# Altium project base_tiempo.PrjPcb
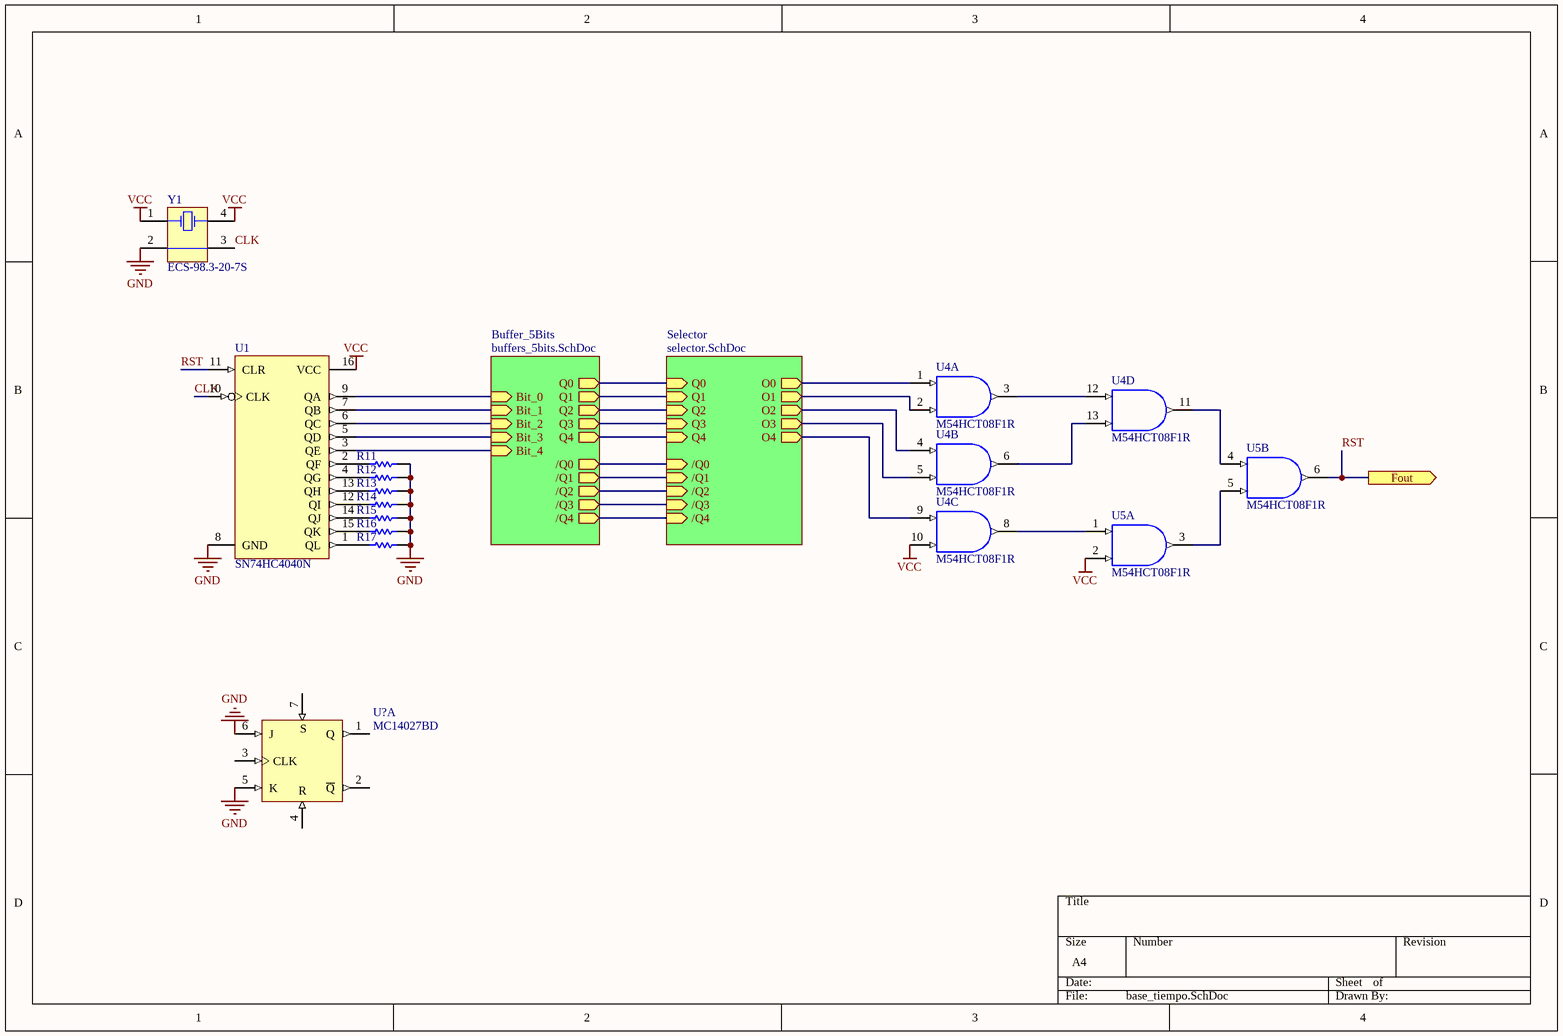
[diagram p0: base_tiempo.SchDoc]
3 sheets, 26 parts. Net scope: hierarchical (ports join the sheet entries above them; power ports are global).
Board file: base_tiempo.PcbDoc
Sheets:
  base_tiempo.SchDoc
    Buffer_5Bits = buffers_5bits.SchDoc
    Selector = selector.SchDoc

## Sheet base_tiempo.SchDoc: Base de tiempo
size A4; Revision: 1

### Parts
R11  Res Semi  [2012[0805]]  (value not drawn)
R12  Res Semi  [2012[0805]]  (value not drawn)
R13  Res Semi  [2012[0805]]  (value not drawn)
R14  Res Semi  [2012[0805]]  (value not drawn)
R15  Res Semi  [2012[0805]]  (value not drawn)
R16  Res Semi  [2012[0805]]  (value not drawn)
R17  Res Semi  [2012[0805]]  (value not drawn)
U1  SN74HC4040N  [N016]
U4  M54HCT08F1R  [CDIP14]  (parts A,B,C,D of 4)
U5  M54HCT08F1R  [CDIP14]  (parts A,B of 4)
U?  MC14027BD  [751B-05_N]  (part A of 2)
Y1  ECS-98.3-20-7S  [ECX-3S]

### Sub-sheets
Buffer_5Bits = buffers_5bits.SchDoc: Bit_0 (in), Bit_1 (in), Bit_2 (in), Bit_3 (in), Bit_4 (in), Q0 (out), Q1 (out), Q2 (out), Q3 (out), Q4 (out), /Q0 (out), /Q1 (out), /Q2 (out), /Q3 (out), /Q4 (out)
Selector = selector.SchDoc: Q0 (in), Q1 (in), Q2 (in), Q3 (in), Q4 (in), /Q0 (in), /Q1 (in), /Q2 (in), /Q3 (in), /Q4 (in), O0 (out), O1 (out), O2 (out), O3 (out), O4 (out)

### Ports
Fout (out)

### Nets
GND: R11.2 R12.2 R13.2 R14.2 R15.2 R16.2 R17.2 U1.8(GND) U4.7(GND) U5.7(GND) U?.5(K) U?.6(J) U?.8(GND) Y1.2(COM)
VCC: U1.16(VCC) U4.10(B) U4.14(VCC) U5.2(B) U5.14(VCC) Y1.1(OSC1) Y1.4(OSC2)
VDD: U?.16(VDD)
/Sel_B_0: sheet Buffer_5Bits//Q0, sheet Selector//Q0
/Sel_B_1: sheet Buffer_5Bits//Q1, sheet Selector//Q1
/Sel_B_2: sheet Buffer_5Bits//Q2, sheet Selector//Q2
/Sel_B_3: sheet Buffer_5Bits//Q3, sheet Selector//Q3
/Sel_B_4: sheet Buffer_5Bits//Q4, sheet Selector//Q4
B_0: U1.9(QA) ; sheet Buffer_5Bits/Bit_0
B_1: U1.7(QB) ; sheet Buffer_5Bits/Bit_1
B_2: U1.6(QC) ; sheet Buffer_5Bits/Bit_2
B_3: U1.5(QD) ; sheet Buffer_5Bits/Bit_3
B_4: U1.3(QE) ; sheet Buffer_5Bits/Bit_4
CLK: U1.10(CLK) Y1.3(COM)
O_0: U4.1(A) ; sheet Selector/O0
O_1: U4.2(B) ; sheet Selector/O1
O_2: U4.4(A) ; sheet Selector/O2
O_3: U4.5(B) ; sheet Selector/O3
O_4: U4.9(A) ; sheet Selector/O4
RST: U1.11(CLR) U5.6(Y) ; port Fout
Sel_B_0: sheet Buffer_5Bits/Q0, sheet Selector/Q0
Sel_B_1: sheet Buffer_5Bits/Q1, sheet Selector/Q1
Sel_B_2: sheet Buffer_5Bits/Q2, sheet Selector/Q2
Sel_B_3: sheet Buffer_5Bits/Q3, sheet Selector/Q3
Sel_B_4: sheet Buffer_5Bits/Q4, sheet Selector/Q4
NetR11_1: R11.1 U1.2(QF)
NetR12_1: R12.1 U1.4(QG)
NetR13_1: R13.1 U1.13(QH)
NetR14_1: R14.1 U1.12(QI)
NetR15_1: R15.1 U1.14(QJ)
NetR16_1: R16.1 U1.15(QK)
NetR17_1: R17.1 U1.1(QL)
NetU4_3: U4.3(Y) U4.12(A)
NetU4_6: U4.6(Y) U4.13(B)
NetU4_8: U4.8(Y) U5.1(A)
NetU4_11: U4.11(Y) U5.4(A)
NetU5_3: U5.3(Y) U5.5(B)

Not connected (* = marked no-connect by the designer): U? 1(Q) 2(~{Q}) 3(CLK) 4(R) 7(S)

### Library data of the parts
R11-R17 = Res Semi: Semiconductor Resistor; Value: 1K; Published: 8-Jun-2000; LatestRevisionDate: 17-Jul-2002; LatestRevisionNote: Re-released for DXP Platform.; PackageReference: AXIAL-0.5; Publisher: Altium Limited
U1 = SN74HC4040N: 12-Bit Asynchronous Binary Counter; Published: 8-Jun-2000; LatestRevisionDate: 04-Mar-2005; LatestRevisionNote: Stylized 3D Model Added.; DatasheetVersion: May-1997; PackageVersion: Oct-1995; PackageReference: N016; Publisher: Altium Limited; PackageDescription: DIP; 16 Leads; Row Spacing 7.62 mm; Pitch 2.54 mm; Code_JEDEC: MS-001-BB; ComponentLink1Description: Manufacturer Link; ComponentLink1URL: http://www.ti.com/; ComponentLink2Description: Datasheet; ComponentLink2URL: http://www-s.ti.com/sc/ds/sn74hc4040.pdf
U4 U5 = M54HCT08F1R: Quad 2-Input AND Gate; Published: 8-Jun-2000; LatestRevisionDate: 06-Jun-2005; LatestRevisionNote: Stylized 3D Model Added.; DatasheetVersion: Feb-1993; PackageReference: CDIP14; Publisher: Altium Limited; PackageDescription: DIP; 14 Leads; Row Spacing 7.62 mm; Pitch 2.54 mm; ComponentLink1Description: Manufacturer Link; ComponentLink1URL: http://www.st.com/
U? = MC14027BD: Dual J-K Flip-Flop; Published: 15-Apr-2002; LatestRevisionDate: 13-Apr-2006; LatestRevisionNote: IPC-7351 Footprint Added.; DatasheetVersion: 1995; PackageVersion: Oct-1999; PackageReference: 751B-05; Publisher: Altium Limited; PackageDescription: 16-Pin Small Outline Integrated Circuit 1.27 mm Pitch; Code_JEDEC: MS-012-AC; Code_IPC: SOIC127P600-16; ComponentLink1Description: Manufacturer Link; ComponentLink1URL: http://www.onsemi.com/; ComponentLink2Description: Datasheet; ComponentLink2URL: http://www.onsemi.com/pub/Collateral/MC14027B-D.PDF
Y1 = ECS-98.3-20-7S: Crystal Oscillator; Published: 17-Jul-2002; DatasheetDocument: 18-Apr-2000; PackageReference: ECX-3S; Publisher: Altium Limited; ComponentLink1Description: Manufacturer Link; ComponentLink1URL: http://www.ecsxtal.com/; ComponentLink2Description: Datasheet; ComponentLink2URL: http://www.ecsxtal.com/pdf/ecx-3s.pdf

## Sheet buffers_5bits.SchDoc
size A4
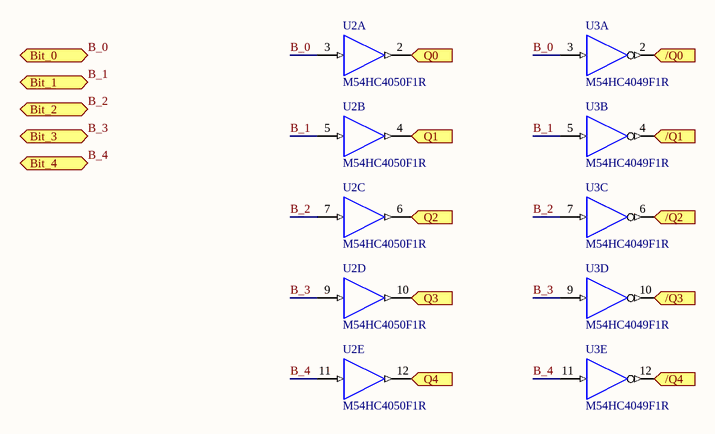
[diagram p1: buffers_5bits.SchDoc]

### Parts
U2  M54HC4050F1R  [DIP16]  (parts A,B,C,D,E of 6)
U3  M54HC4049F1R  [DIP16]  (parts A,B,C,D,E of 6)

### Ports
/Q0 (out), /Q1 (out), /Q2 (out), /Q3 (out), /Q4 (out), Bit_0 (in), Bit_1 (in), Bit_2 (in), Bit_3 (in), Bit_4 (in), Q0 (out), Q1 (out), Q2 (out), Q3 (out), Q4 (out)

### Nets
GND: U2.8(GND) U3.8(GND)
VCC: U2.1(VCC) U3.1(VCC)
/Sel_B_0: U3.2(Y) ; port /Q0
/Sel_B_1: U3.4(Y) ; port /Q1
/Sel_B_2: U3.6(Y) ; port /Q2
/Sel_B_3: U3.10(Y) ; port /Q3
/Sel_B_4: U3.12(Y) ; port /Q4
B_0: U2.3(A) U3.3(A) ; port Bit_0
B_1: U2.5(A) U3.5(A) ; port Bit_1
B_2: U2.7(A) U3.7(A) ; port Bit_2
B_3: U2.9(A) U3.9(A) ; port Bit_3
B_4: U2.11(A) U3.11(A) ; port Bit_4
Sel_B_0: U2.2(Y) ; port Q0
Sel_B_1: U2.4(Y) ; port Q1
Sel_B_2: U2.6(Y) ; port Q2
Sel_B_3: U2.10(Y) ; port Q3
Sel_B_4: U2.12(Y) ; port Q4

### Library data of the parts
U2 = M54HC4050F1R: Hex Buffer/Converter Non-Inverting; Note: Pins 13 and 16 are not connected and not drawn.; Published: 8-Jun-2000; LatestRevisionDate: 06-Jun-2005; LatestRevisionNote: Stylized 3D Model Added.; DatasheetVersion: Mar-1993; PackageVersion: Apr-1996; PackageReference: DIP16; Publisher: Altium Limited; PackageDescription: DIP; 16 Leads; Row Spacing 7.62 mm; Pitch 2.54 mm; ComponentLink1Description: Manufacturer Link; ComponentLink1URL: http://www.st.com/
U3 = M54HC4049F1R: Hex Buffer/Converter Invertering; Note: Pins 13 and 16 are not connected and not drawn.; Published: 8-Jun-2000; LatestRevisionDate: 06-Jun-2005; LatestRevisionNote: Stylized 3D Model Added.; DatasheetVersion: Mar-1993; PackageVersion: Apr-1996; PackageReference: DIP16; Publisher: Altium Limited; PackageDescription: DIP; 16 Leads; Row Spacing 7.62 mm; Pitch 2.54 mm; ComponentLink1Description: Manufacturer Link; ComponentLink1URL: http://www.st.com/

## Sheet selector.SchDoc
size A4
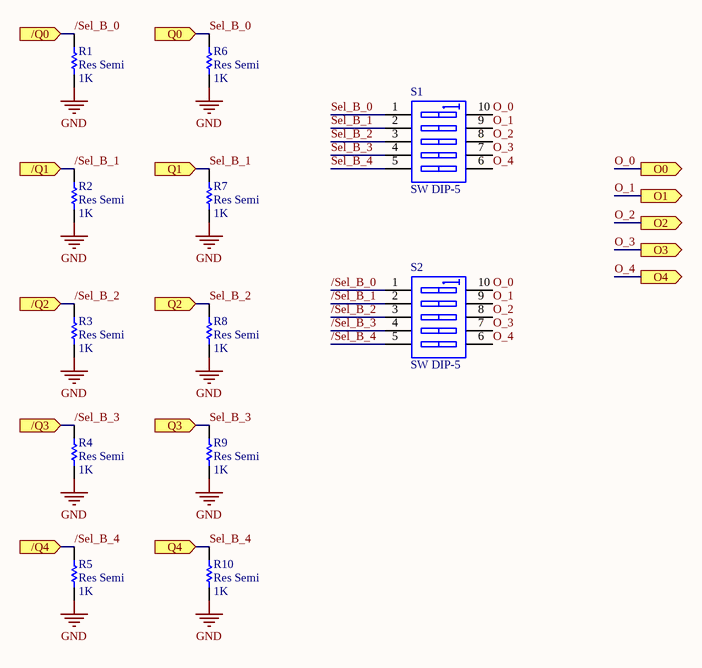
[diagram p2: selector.SchDoc]

### Parts
R1  Res Semi  value 1K  [2012[0805]]
R2  Res Semi  value 1K  [2012[0805]]
R3  Res Semi  value 1K  [2012[0805]]
R4  Res Semi  value 1K  [2012[0805]]
R5  Res Semi  value 1K  [2012[0805]]
R6  Res Semi  value 1K  [2012[0805]]
R7  Res Semi  value 1K  [2012[0805]]
R8  Res Semi  value 1K  [2012[0805]]
R9  Res Semi  value 1K  [2012[0805]]
R10  Res Semi  value 1K  [2012[0805]]
S1  SW DIP-5  [N10A]
S2  SW DIP-5  [N10A]

### Ports
/Q0 (in), /Q1 (in), /Q2 (in), /Q3 (in), /Q4 (in), O0 (out), O1 (out), O2 (out), O3 (out), O4 (out), Q0 (in), Q1 (in), Q2 (in), Q3 (in), Q4 (in)

### Nets
GND: R1.1 R2.1 R3.1 R4.1 R5.1 R6.1 R7.1 R8.1 R9.1 R10.1
/Sel_B_0: R1.2 S2.1(A1) ; port /Q0
/Sel_B_1: R2.2 S2.2(A2) ; port /Q1
/Sel_B_2: R3.2 S2.3(A3) ; port /Q2
/Sel_B_3: R4.2 S2.4(A4) ; port /Q3
/Sel_B_4: R5.2 S2.5(A5) ; port /Q4
O_0: S1.10(B1) S2.10(B1) ; port O0
O_1: S1.9(B2) S2.9(B2) ; port O1
O_2: S1.8(B3) S2.8(B3) ; port O2
O_3: S1.7(B4) S2.7(B4) ; port O3
O_4: S1.6(B5) S2.6(B5) ; port O4
Sel_B_0: R6.2 S1.1(A1) ; port Q0
Sel_B_1: R7.2 S1.2(A2) ; port Q1
Sel_B_2: R8.2 S1.3(A3) ; port Q2
Sel_B_3: R9.2 S1.4(A4) ; port Q3
Sel_B_4: R10.2 S1.5(A5) ; port Q4

### Library data of the parts
R1-R10 = Res Semi: Semiconductor Resistor; Published: 8-Jun-2000; LatestRevisionDate: 17-Jul-2002; LatestRevisionNote: Re-released for DXP Platform.; PackageReference: AXIAL-0.5; Publisher: Altium Limited
S1 S2 = SW DIP-5: DIP Switch, 5 Position, SPST; Published: 24-Mar-1999; LatestRevisionDate: 17-Jul-2002; LatestRevisionNote: Re-released for DXP Platform.; PackageReference: N10A; Publisher: Altium Limited

## Nets that join several sheets
GND: base_tiempo (14 pins), buffers_5bits (U2.8 U3.8), selector (10 pins)
VCC: base_tiempo (7 pins), buffers_5bits (U2.1 U3.1)
/Sel_B_0: buffers_5bits (U3.2), selector (R1.2 S2.1)
/Sel_B_1: buffers_5bits (U3.4), selector (R2.2 S2.2)
/Sel_B_2: buffers_5bits (U3.6), selector (R3.2 S2.3)
/Sel_B_3: buffers_5bits (U3.10), selector (R4.2 S2.4)
/Sel_B_4: buffers_5bits (U3.12), selector (R5.2 S2.5)
B_0: base_tiempo (U1.9), buffers_5bits (U2.3 U3.3)
B_1: base_tiempo (U1.7), buffers_5bits (U2.5 U3.5)
B_2: base_tiempo (U1.6), buffers_5bits (U2.7 U3.7)
B_3: base_tiempo (U1.5), buffers_5bits (U2.9 U3.9)
B_4: base_tiempo (U1.3), buffers_5bits (U2.11 U3.11)
O_0: base_tiempo (U4.1), selector (S1.10 S2.10)
O_1: base_tiempo (U4.2), selector (S1.9 S2.9)
O_2: base_tiempo (U4.4), selector (S1.8 S2.8)
O_3: base_tiempo (U4.5), selector (S1.7 S2.7)
O_4: base_tiempo (U4.9), selector (S1.6 S2.6)
Sel_B_0: buffers_5bits (U2.2), selector (R6.2 S1.1)
Sel_B_1: buffers_5bits (U2.4), selector (R7.2 S1.2)
Sel_B_2: buffers_5bits (U2.6), selector (R8.2 S1.3)
Sel_B_3: buffers_5bits (U2.10), selector (R9.2 S1.4)
Sel_B_4: buffers_5bits (U2.12), selector (R10.2 S1.5)